# EAGLE design dps (EAGLE 6.4)
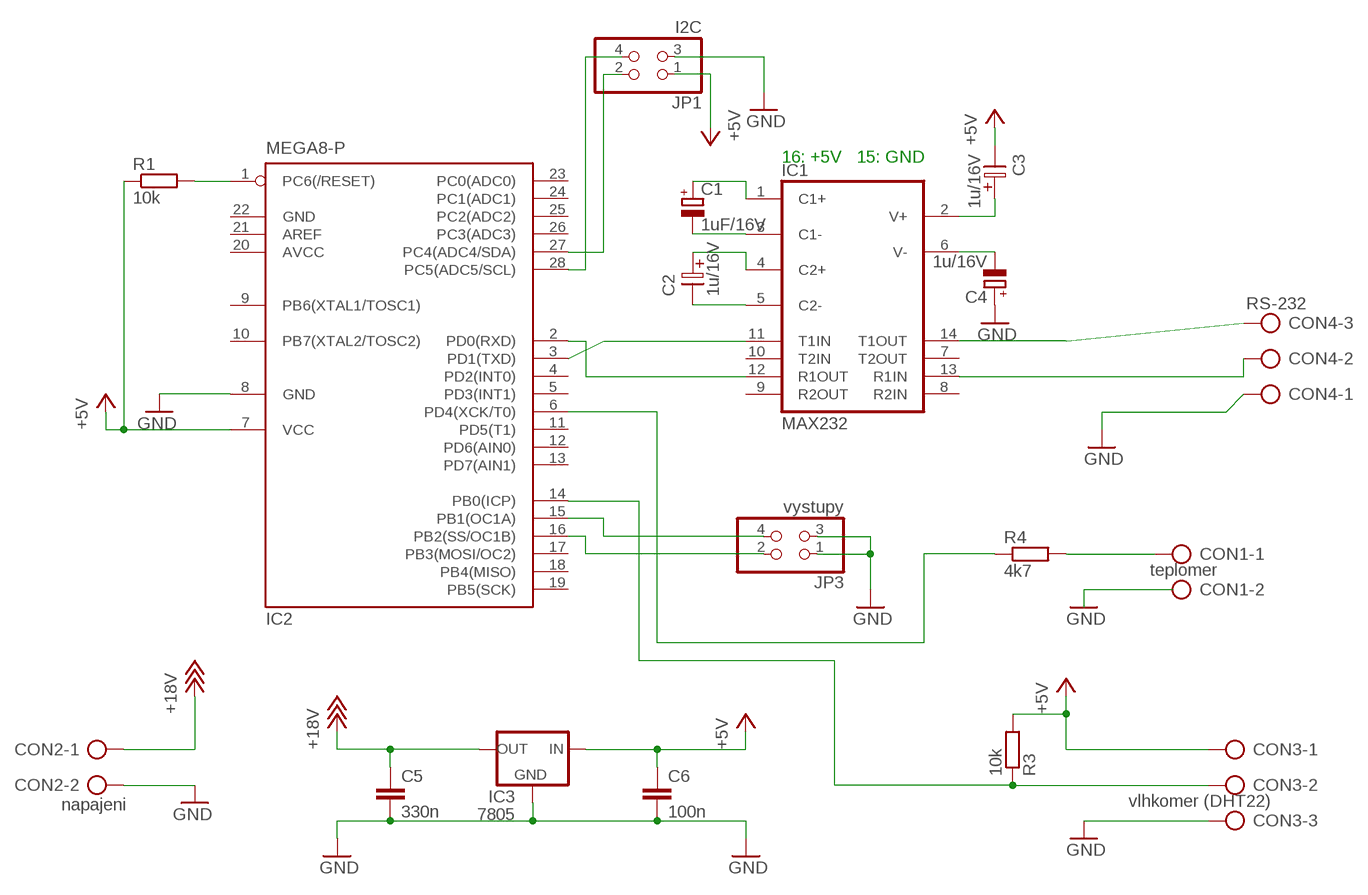
[diagram p0: schematic, sheet 1]

## Parts
C1  1uF/16V  CPOL-EUTT5D9  [TT5D9]
C2  1u/16V  ELC-2,5L  [ES-2,5L]
C3  1u/16V  ELC-2,5L  [ES-2,5L]
C4  1u/16V  CPOL-EUTT5D9  [TT5D9]
C5  330n  C-EU025-025X050  [C025-025X050]
C6  100n  C-EU025-025X050  [C025-025X050]
CON1  teplomer  AK500/2  [AK500/2]
CON2  napajeni  AK500/2  [AK500/2]
CON3  vlhkomer (DHT22)  AK500/3  [AK500/3]
CON4  RS-232  AK500/3  [AK500/3]
IC1  MAX232  [DIL16]
IC2  MEGA8-P  [DIL28-3]
IC3  7805  V_REG_78XXSIDE  [78XXL]
JP1  I2C  PINHD-2X2  [2X02]
JP3  vystupy  PINHD-2X2  [2X02]
R1  10k  R-EU_0207/7  [0207/7]
R3  10k  R-EU_0207/7  [0207/7]
R4  4k7  R-EU_0207/15  [0207/15]

## Nets
+5V: C3.2 C6.1 CON3.1 IC2.7(VCC) IC3.IN JP1.1 R1.1 R3.2
+18V: C5.1 CON2.1 IC3.OUT
GND: C4.+ C5.2 C6.2 CON2.2 CON3.3 CON4.1 IC2.8(GND) IC3.GND JP1.3 JP3.1 JP3.3
N$2: IC1.12(R1OUT) IC2.2(PD0(RXD))
N$3: C1.+ IC1.1(C1+)
N$4: C1.- IC1.3(C1-)
N$5: C2.1 IC1.4(C2+)
N$6: C2.2 IC1.5(C2-)
N$7: C3.1 IC1.2(V+)
N$8: C4.- IC1.6(V-)
N$9: IC1.11(T1IN) IC2.3(PD1(TXD))
N$10: CON4.3 IC1.14(T1OUT)
N$11: CON4.2 IC1.13(R1IN)
N$12: IC2.28(PC5(ADC5/SCL)) JP1.4
N$13: CON1.1 R4.2
N$14: IC2.16(PB2(SS/OC1B)) JP3.2
N$15: IC2.15(PB1(OC1A)) JP3.4
N$16: IC2.6(PD4(XCK/T0)) R4.1
N$17: IC2.27(PC4(ADC4/SDA)) JP1.2
N$18: CON3.2 IC2.14(PB0(ICP)) R3.1
N$22: IC2.1(PC6(/RESET)) R1.2
Unconnected: CON1.2 IC1.7(T2OUT) IC1.8(R2IN) IC1.9(R2OUT) IC1.10(T2IN) IC2.4(PD2(INT0)) IC2.5(PD3(INT1)) IC2.9(PB6(XTAL1/TOSC1)) IC2.10(PB7(XTAL2/TOSC2)) IC2.11(PD5(T1)) IC2.12(PD6(AIN0)) IC2.13(PD7(AIN1)) IC2.17(PB3(MOSI/OC2)) IC2.18(PB4(MISO)) IC2.19(PB5(SCK)) IC2.21(AREF) IC2.23(PC0(ADC0)) IC2.24(PC1(ADC1)) IC2.25(PC2(ADC2)) IC2.26(PC3(ADC3))

## Notes on the sheet
- 16: +5V   15: GND

## Power pins joined to a net without a drawn wire
+5V: IC1.16(VCC)
AVCC: IC2.20(AVCC)
GND: IC1.15(GND) IC2.22(GND)

## Library data of the parts
C1 C4 = resistor:CPOL-EU: POLARIZED CAPACITOR, European symbol
C2 C3 = discrete:ELC-2,5L
C5 C6 = resistor:C-EU: CAPACITOR, European symbol
CON1 CON2 = #Svorkovnice:AK500/2: CONNECTOR
CON3 CON4 = #Svorkovnice:AK500/3: CONNECTOR
IC1 = maxim:MAX232: RS232 TRANSEIVER; MF: MAXIM; MPN: MAX232ACPE+; OC_FARNELL: 9723773; OC_NEWARK: 68K4544
IC2 = atmel:MEGA8-P: MICROCONTROLLER 8 Kbytes FLASH, 1 kbytes SRAM, 512 bytes EEPROM, USART, 4-channel 10 bit ADC, 2-channel 8 bit ADC Pin compatible with Atmega48, ATMega88, ATMega168 Source: avr.lbr; OC_FARNELL: unknown; OC_NEWARK: unknown
IC3 = SparkFun:V_REG_78XX: Voltage Regulator Standard 7805 5V regulator. IGO (Input Ground Output). Spark Fun Electronics SKU : COM-00107
JP1 JP3 = pinhead:PINHD-2X2: PIN HEADER
R1 R3 R4 = resistor:R-EU_: RESISTOR, European symbol

## Board
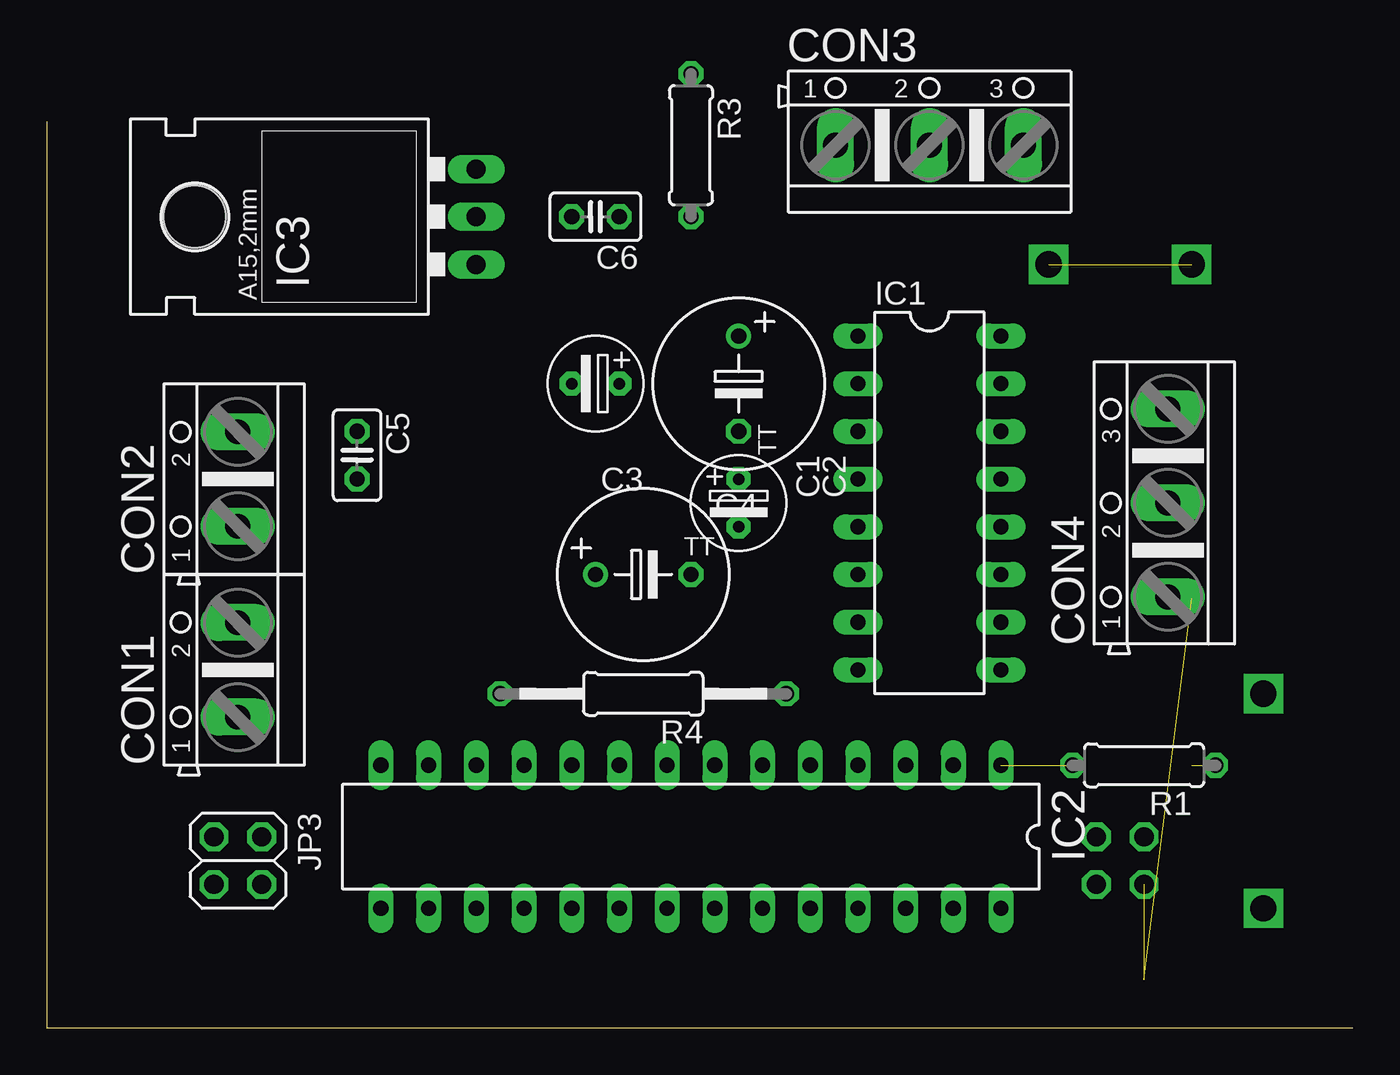
[diagram p1: board, top side]
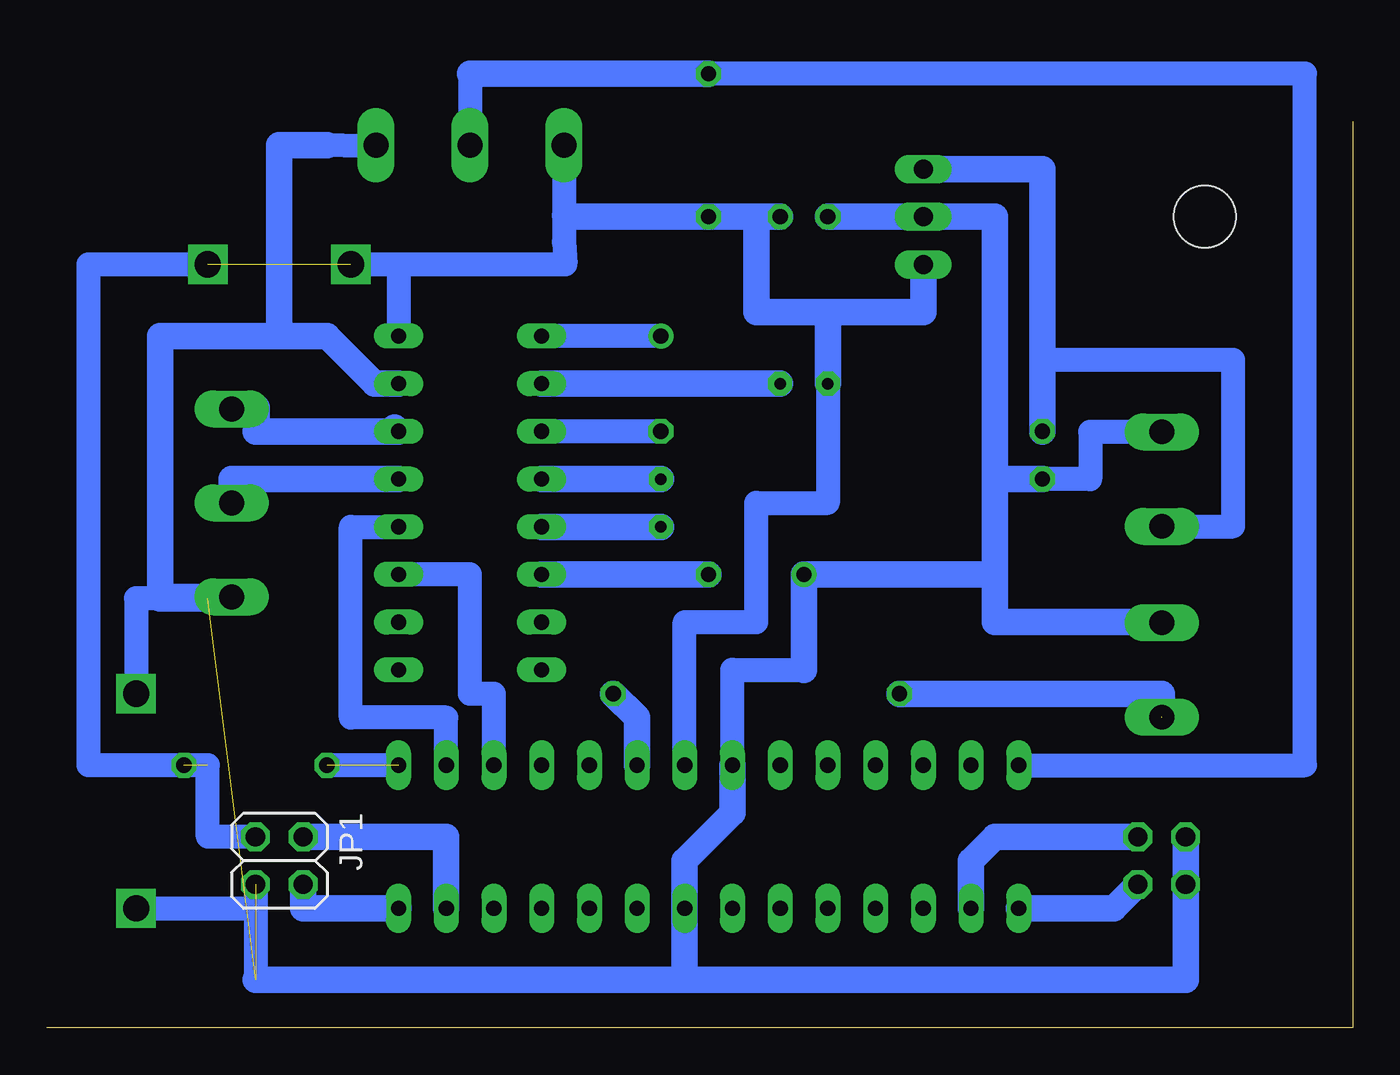
[diagram p2: board, bottom side, seen from below]

Size 69.52 x 48.25 mm. Coordinates in mm from the lower left corner, seen from the top.
Outline: 69.52,0 0,0 0,48.25
Copper layers (1*16): Top 0.035mm / dielectric 1.5mm / Bottom 0.035mm
Design rules "default": minimum track width 10mil, minimum drill 24mil, track to track 8mil, track to pad 8mil, pad to pad 8mil, via to via 8mil, smd to smd 8mil, copper to edge 40mil, drill to drill 8mil, minimum pad ring 10mil, minimum via ring 8mil, stop-mask expansion 4mil, vias tented up to drill 0mil, thermal gap 10mil

### Footprints (pad centres in the part's own frame; a part is rotated, then mirrored left to right if it is on the bottom)
TT5D9 = drill 0.813: + -2.54,0 | drill 0.813 octagon: - 2.54,0
ES-2,5L = drill 0.61 pad 1.27 octagon: 1 0,0; 2 2.54,0
C025-025X050 = drill 0.813 octagon: 1 -1.27,0; 2 1.27,0
AK500/2 = drill 1.321 long: 1 -2.515,0; 2 2.515,0
AK500/3 = drill 1.321 long: 1 -5.004,0; 2 0,0; 3 5.004,0
DIL16 = drill 0.813 long: 1 -8.89,-3.81; 2 -6.35,-3.81; 3 -3.81,-3.81; 4 -1.27,-3.81; 5 1.27,-3.81; 6 3.81,-3.81; 7 6.35,-3.81; 8 8.89,-3.81; 9 8.89,3.81; 10 6.35,3.81; 11 3.81,3.81; 12 1.27,3.81; 13 -1.27,3.81; 14 -3.81,3.81; 15 -6.35,3.81; 16 -8.89,3.81
DIL28-3 = drill 0.813 long: 1 -16.51,-3.81; 2 -13.97,-3.81; 3 -11.43,-3.81; 4 -8.89,-3.81; 5 -6.35,-3.81; 6 -3.81,-3.81; 7 -1.27,-3.81; 8 1.27,-3.81; 9 3.81,-3.81; 10 6.35,-3.81; 11 8.89,-3.81; 12 11.43,-3.81; 13 13.97,-3.81; 14 16.51,-3.81; 15 16.51,3.81; 16 13.97,3.81; 17 11.43,3.81; 18 8.89,3.81; 19 6.35,3.81; 20 3.81,3.81; 21 1.27,3.81; 22 -1.27,3.81; 23 -3.81,3.81; 24 -6.35,3.81; 25 -8.89,3.81; 26 -11.43,3.81; 27 -13.97,3.81; 28 -16.51,3.81
78XXL = drill 1.016 long: GND 0,-3.81; IN -2.54,-3.81; OUT 2.54,-3.81 | hole 3.302: 0,11.176
2X02 = drill 1.016 octagon: 1 -1.27,-1.27; 2 -1.27,1.27; 3 1.27,-1.27; 4 1.27,1.27
0207/7 = drill 0.813 octagon: 1 -3.81,0; 2 3.81,0
0207/15 = drill 0.813 octagon: 1 -7.62,0; 2 7.62,0

### Placement (x,y rotation side)
C1  36.83,34.29 270 top
C2  36.83,29.21 270 top
C3  30.48,34.29 180 top
C4  31.75,24.13 0 top
C5  16.51,30.48 270 top
C6  29.21,43.18 180 top
CON1  10.16,19.05 90 top
CON2  10.16,29.21 90 top
CON3  46.99,46.99 0 top
CON4  59.69,27.94 90 top
IC1  46.99,27.94 270 top
IC2  34.29,10.16 180 top
IC3  19.05,43.18 90 top
JP1  57.15,8.89 270 bottom
JP3  10.16,8.89 270 top
R1  58.42,13.97 180 top
R3  34.29,46.99 270 top
R4  31.75,17.78 180 top

### Tracks (layer width: path | path; a pad name or v marks a point on that pad's centre or on a via)
+5V  (via drill 1.4)  (2 unrouted)
  Bottom 1.27: C3.2 27.94,27.94 31.75,27.94 31.75,21.59 35.56,21.59 IC2.7 | 41.91,43.18 41.99,43.26 CON3.1 41.99,41.83 41.91,40.64 50.8,40.64 | 50.8,40.64 IC1.16 | 50.8,40.64 53.34,40.64 | JP1.1 60.96,10.16 60.96,13.97 67.31,13.97 67.31,40.64 v60.96,40.64
  Bottom 1.422: 41.91,43.18 R3.2 | C6.1 R3.2 | IC3.IN 22.86,38.1 27.94,38.1 | C3.2 27.94,38.1 | 27.94,38.1 31.75,38.1 31.75,43.18 R3.2
+18V
  Bottom 1.27: CON2.1 6.35,26.69 6.35,35.56 16.51,35.56
  Bottom 1.422: IC3.OUT 16.51,45.72 16.51,35.56 C5.1
GND  (2 unrouted)
  Bottom 1.27: JP3.3 JP3.1 | IC2.8 33.02,19.05 29.21,19.05 | CON2.2 13.97,31.72 13.97,29.21 C5.2 | CON3.3 51.99,46.91 54.61,46.99 | JP1.3 58.42,2.54
  Bottom 1.422: 60.96,22.86 63.5,22.86 63.5,22.94 | 63.5,22.94 63.5,36.83 57.15,36.83 | 54.61,46.99 57.15,46.99 57.15,36.83 | 57.15,36.83 54.61,36.83 52.07,34.29 IC1.15 | C6.2 IC3.GND 19.05,43.18 19.05,29.21 | 19.05,29.21 C5.2 | 19.05,29.21 19.05,24.13 | 19.05,24.13 C4.+ 29.21,19.05 | 35.56,5.08 IC2.22 | IC2.22 35.56,8.89 33.02,11.43 IC2.8 | JP3.1 8.89,2.54 35.56,2.54 | IC2.22 35.56,2.54 | 35.56,2.54 58.42,2.54 | CON4.1 63.5,22.94 | 10.16,21.59 19.05,21.59 19.05,24.13
N$1  (via drill 1.4)
  other vias: 53.34,40.64
N$2
  Bottom 1.27: IC2.2 48.26,16.51 53.34,16.51 53.34,26.67 IC1.12
N$3
  Bottom 1.27: C1.+ IC1.1
N$4
  Bottom 1.27: C1.- IC1.3
N$5
  Bottom 1.422: IC1.4 C2.1
N$6
  Bottom 1.422: IC1.5 C2.2
N$7
  Bottom 1.422: IC1.2 C3.1
N$8
  Bottom 1.422: IC1.6 C4.-
N$9
  Bottom 1.27: IC2.3 45.72,17.78 46.99,17.78 46.99,24.13 IC1.11
N$10
  Bottom 1.422: 51,31.95 IC1.14 58.42,31.75 58.34,31.83 58.34,33.02 CON4.3
N$11
  Bottom 1.422: IC1.13 59.69,29.21 CON4.2
N$12
  Bottom 1.422: IC2.28 55.88,6.35 JP1.4
N$13  (1 unrouted)
  Bottom 1.422: R4.2 10.16,17.78 10.16,16.51
N$14
  Bottom 1.422: JP3.2 19.05,10.16 20.32,8.89 IC2.16
N$15
  Bottom 1.422: IC2.15 12.7,6.35 JP3.4
N$16
  Bottom 1.422: IC2.6 38.1,16.51 R4.1
N$17
  Bottom 1.422: IC2.27 48.26,10.16 JP1.2
N$18
  Bottom 1.27: IC2.14 2.54,13.97 2.54,50.8 R3.1 | 46.99,50.8 CON3.2
  Bottom 1.422: R3.1 46.99,50.8
N$19  (via drill 1.4)
  Bottom 1.27: v64.77,6.35 58.42,6.35
N$20  (via drill 1.4)
  Bottom 1.27: 59.69,22.86 64.77,22.86 v64.77,17.78
N$22  (1 unrouted)
  Bottom 1.27: IC2.1 R1.2